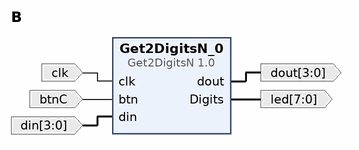
[diagram p0: block diagram of the top level]
# Vivado block design B, xc7a100tcsg324-1, Vivado 2016.4
create_bd_design B

create_bd_port -dir I clk
create_bd_port -dir I btnC
create_bd_port -dir I -from 3 -to 0 din
create_bd_port -dir O -from 3 -to 0 dout
create_bd_port -dir O -from 7 -to 0 led

create_bd_cell -type ip -vlnv ua.pt:user:Get2DigitsN:1.0 Get2DigitsN_0

# ---- connections ----

connect_bd_net [get_bd_ports clk] [get_bd_pins Get2DigitsN_0/clk]
connect_bd_net [get_bd_ports btnC] [get_bd_pins Get2DigitsN_0/btn]
connect_bd_net [get_bd_ports din] [get_bd_pins Get2DigitsN_0/din]
connect_bd_net [get_bd_pins Get2DigitsN_0/dout] [get_bd_ports dout]
connect_bd_net [get_bd_pins Get2DigitsN_0/Digits] [get_bd_ports led]

validate_bd_design
save_bd_design
